# EasyEDA Pro project ESP32_wroom_A_V2.eprj, schematic main_esp32
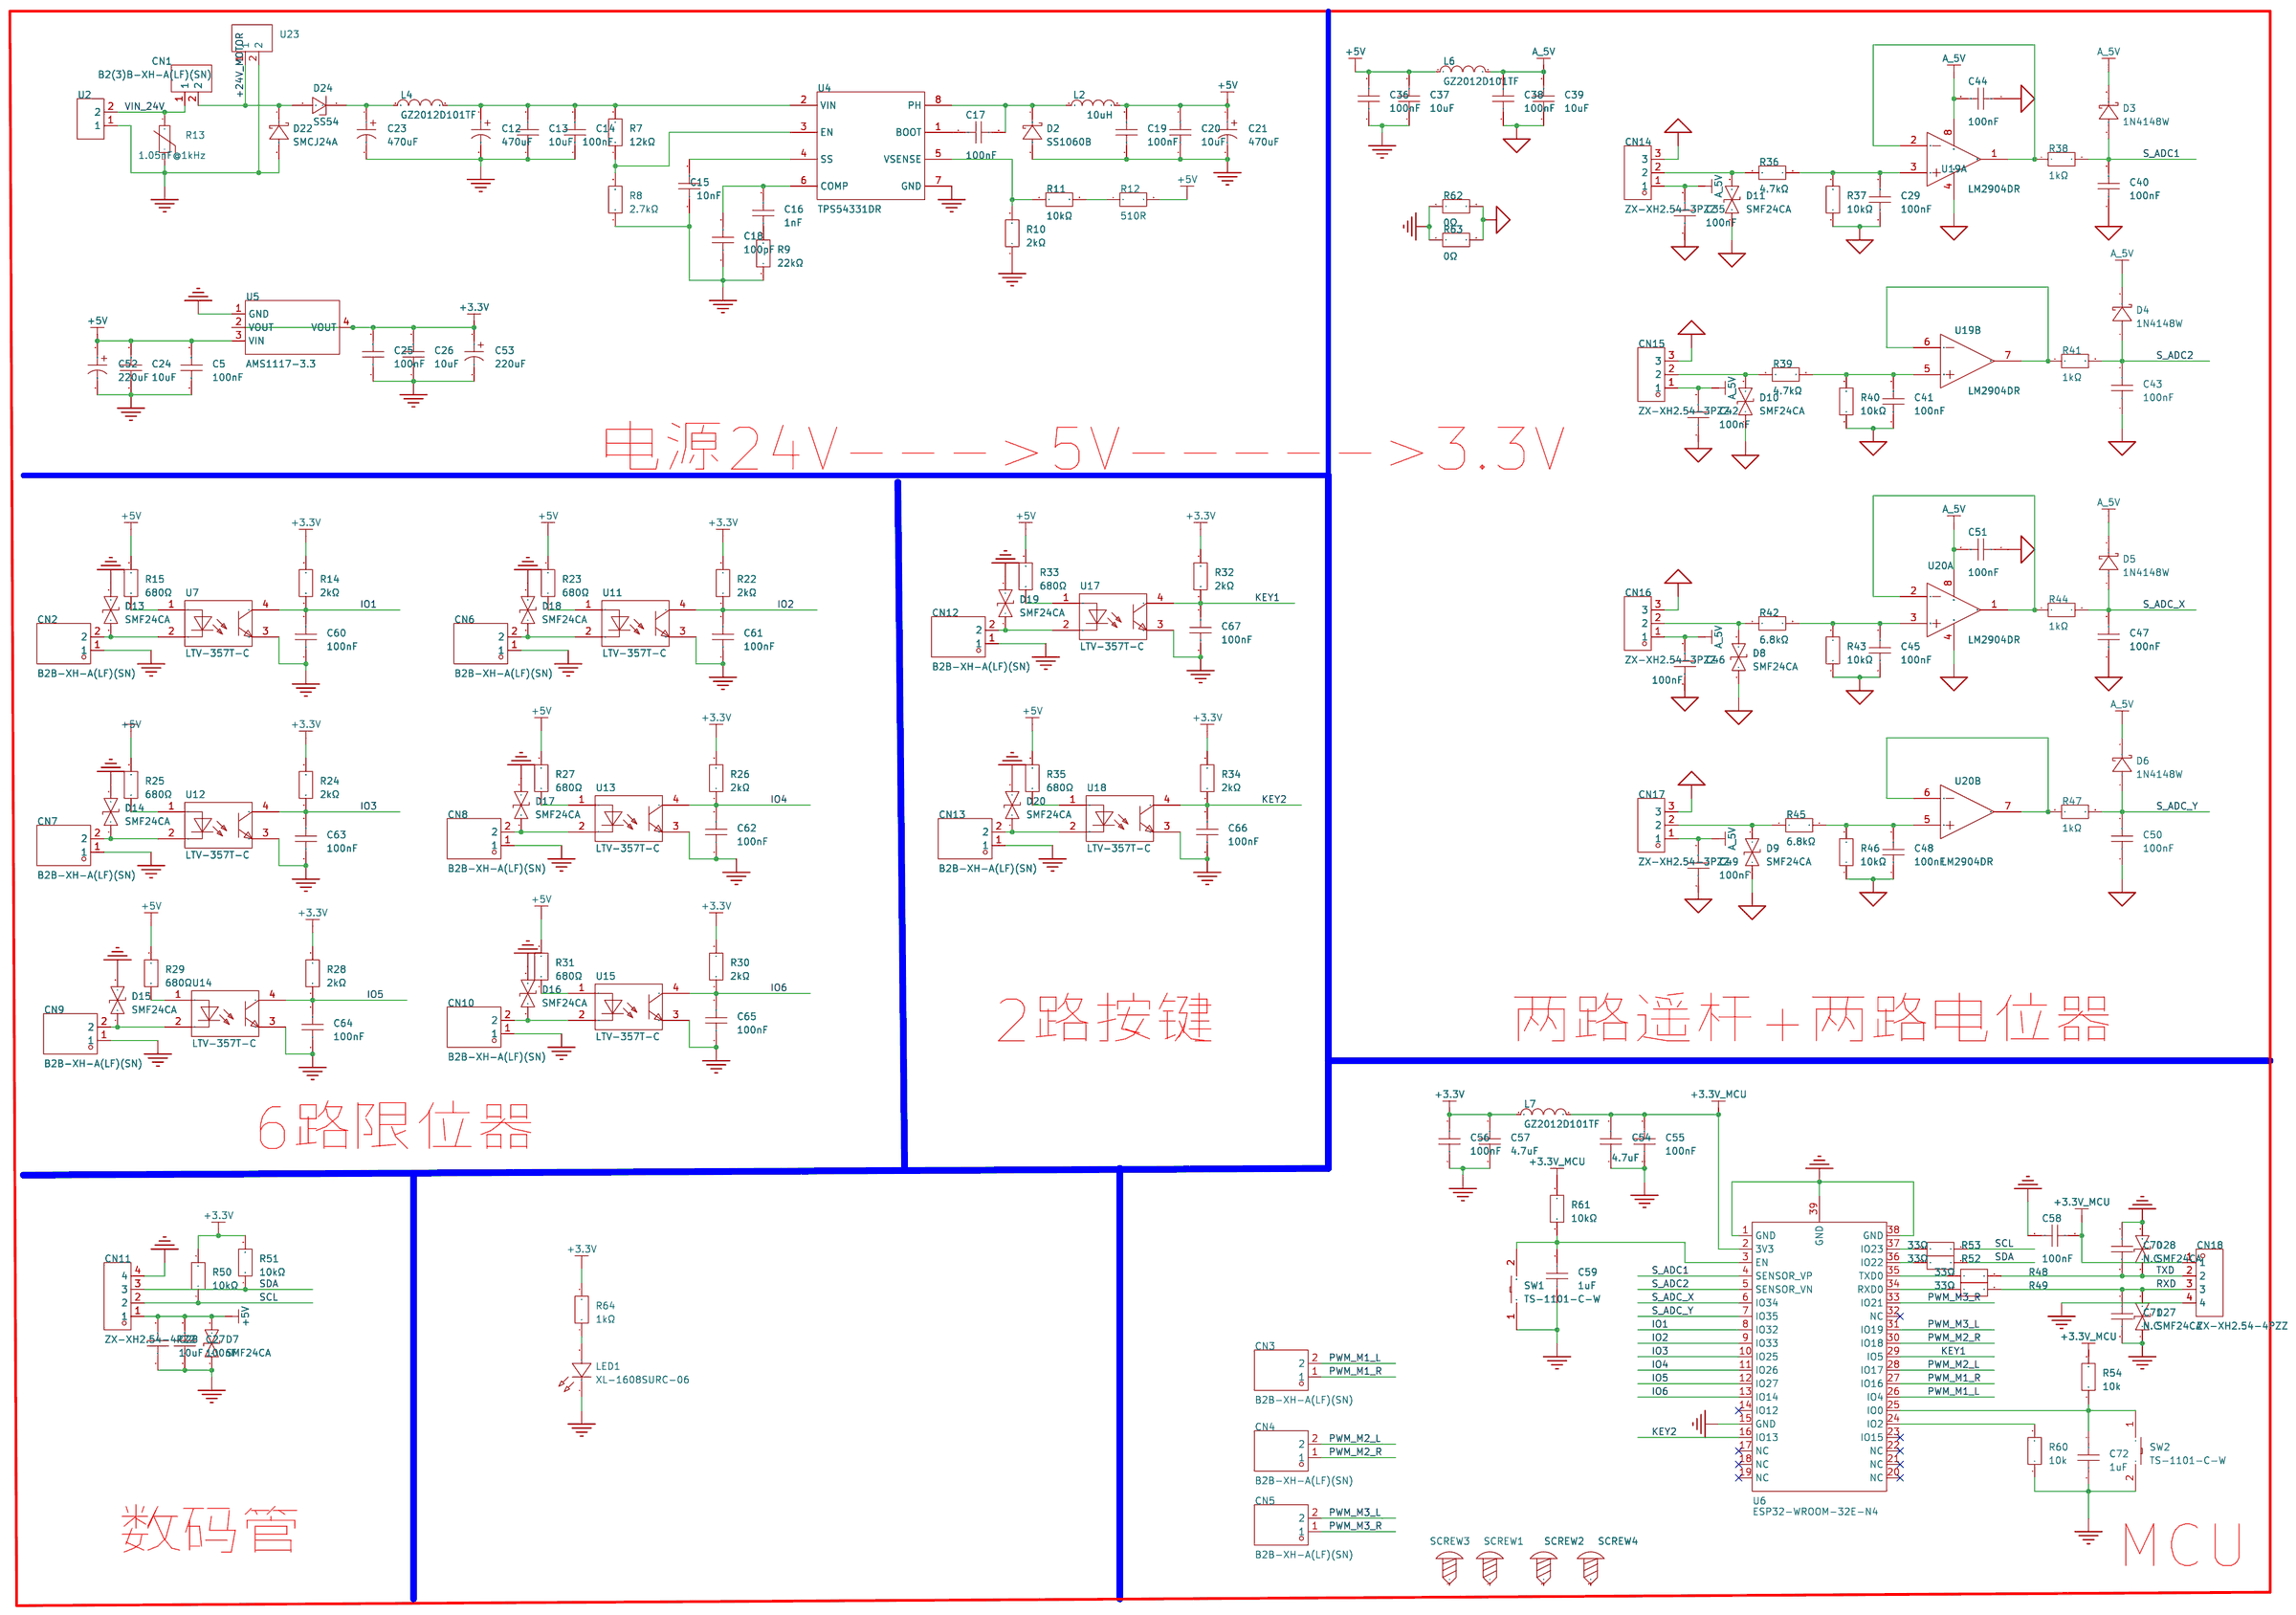
[diagram p0: schematic sheet]

## Parts
C5  100nF  [C0603]
C12  470uF  [CAP-TH_BD10.0-P5.00-D0.6-FD-A]
C13  10uF  [C0805]
C14  100nF  [C0603]
C15  10nF  [C0603]
C16  1nF  [C0603]
C17  100nF  [C0603]
C18  100pF  [C0603]
C19  100nF  [C0603]
C20  10uF  [C0805]
C21  470uF  [CAP-TH_BD10.0-P5.00-D0.6-FD-A]
C23  470uF  [CAP-TH_BD10.0-P5.00-D0.6-FD-A]
C24  10uF  [C0603]
C25  100nF  [C0603]
C26  10uF  [C0603]
C27  100nF  [C0603]
C28  10uF  [C0603]
C29  100nF  [C0603]
C35  100nF  [C0603]
C36  100nF  [C0603]
C37  10uF  [C0603]
C38  100nF  [C0603]
C39  10uF  [C0603]
C40  100nF  [C0603]
C41  100nF  [C0603]
C42  100nF  [C0603]
C43  100nF  [C0603]
C44  100nF  [C0603]
C45  100nF  [C0603]
C46  100nF  [C0603]
C47  100nF  [C0603]
C48  100nF  [C0603]
C49  100nF  [C0603]
C50  100nF  [C0603]
C51  100nF  [C0603]
C52  220uF  [CAP-TH_BD10.0-P5.00-D0.6-FD-A]
C53  220uF  [CAP-TH_BD10.0-P5.00-D0.6-FD-A]
C54  4.7uF  [C0603]
C55  100nF  [C0603]
C56  100nF  [C0603]
C57  4.7uF  [C0603]
C58  100nF  [C0603]
C59  1uF  [C0603]
C60  100nF  [C0603]
C61  100nF  [C0603]
C62  100nF  [C0603]
C63  100nF  [C0603]
C64  100nF  [C0603]
C65  100nF  [C0603]
C66  100nF  [C0603]
C67  100nF  [C0603]
C70  N.C  [C0603]
C71  N.C  [C0603]
C72  1uF  [C0603]
CN1  B2(3)B-XH-A(LF)(SN)  [CONN-TH_2P-V-P5.00-R_B2-3B-XH-A-LF-SN]
CN2  B2B-XH-A(LF)(SN)  [CONN-TH_B2B-XH-A-LF-SN]
CN3  B2B-XH-A(LF)(SN)  [CONN-TH_B2B-XH-A-LF-SN]
CN4  B2B-XH-A(LF)(SN)  [CONN-TH_B2B-XH-A-LF-SN]
CN5  B2B-XH-A(LF)(SN)  [CONN-TH_B2B-XH-A-LF-SN]
CN6  B2B-XH-A(LF)(SN)  [CONN-TH_B2B-XH-A-LF-SN]
CN7  B2B-XH-A(LF)(SN)  [CONN-TH_B2B-XH-A-LF-SN]
CN8  B2B-XH-A(LF)(SN)  [CONN-TH_B2B-XH-A-LF-SN]
CN9  B2B-XH-A(LF)(SN)  [CONN-TH_B2B-XH-A-LF-SN]
CN10  B2B-XH-A(LF)(SN)  [CONN-TH_B2B-XH-A-LF-SN]
CN11  ZX-XH2.54-4PZZ  [CONN-TH_4P-P2.50_4PIN]
CN12  B2B-XH-A(LF)(SN)  [CONN-TH_B2B-XH-A-LF-SN]
CN13  B2B-XH-A(LF)(SN)  [CONN-TH_B2B-XH-A-LF-SN]
CN14  ZX-XH2.54-3PZZ  [CONN-TH_3P-P2.54_2501S-3P]
CN15  ZX-XH2.54-3PZZ  [CONN-TH_3P-P2.54_2501S-3P]
CN16  ZX-XH2.54-3PZZ  [CONN-TH_3P-P2.54_2501S-3P]
CN17  ZX-XH2.54-3PZZ  [CONN-TH_3P-P2.54_2501S-3P]
CN18  ZX-XH2.54-4PZZ  [CONN-TH_4P-P2.50_4PIN]
D2  SS1060B  [SMB_L4.3-W3.6-LS5.3-RD]
D3  1N4148W  [SOD-123_L2.7-W1.6-LS3.7-FD]
D4  1N4148W  [SOD-123_L2.7-W1.6-LS3.7-FD]
D5  1N4148W  [SOD-123_L2.7-W1.6-LS3.7-FD]
D6  1N4148W  [SOD-123_L2.7-W1.6-LS3.7-FD]
D7  SMF24CA  [SOD-123FL_L2.7-W1.8-LS3.8-BI]
D8  SMF24CA  [SOD-123FL_L2.7-W1.8-LS3.8-BI]
D9  SMF24CA  [SOD-123FL_L2.7-W1.8-LS3.8-BI]
D10  SMF24CA  [SOD-123FL_L2.7-W1.8-LS3.8-BI]
D11  SMF24CA  [SOD-123FL_L2.7-W1.8-LS3.8-BI]
D13  SMF24CA  [SOD-123FL_L2.7-W1.8-LS3.8-BI]
D14  SMF24CA  [SOD-123FL_L2.7-W1.8-LS3.8-BI]
D15  SMF24CA  [SOD-123FL_L2.7-W1.8-LS3.8-BI]
D16  SMF24CA  [SOD-123FL_L2.7-W1.8-LS3.8-BI]
D17  SMF24CA  [SOD-123FL_L2.7-W1.8-LS3.8-BI]
D18  SMF24CA  [SOD-123FL_L2.7-W1.8-LS3.8-BI]
D19  SMF24CA  [SOD-123FL_L2.7-W1.8-LS3.8-BI]
D20  SMF24CA  [SOD-123FL_L2.7-W1.8-LS3.8-BI]
D22  SMCJ24A  [SMC_L6.9-W5.9-LS7.9-RD]
D24  SS54  [SMA_L4.3-W2.6-LS5.0-FD]
D27  SMF24CA  [SOD-123FL_L2.7-W1.8-LS3.8-BI]
D28  SMF24CA  [SOD-123FL_L2.7-W1.8-LS3.8-BI]
L2  10uH  [IND-SMD_L7.1-W6.6]
L4  GZ2012D101TF  [L0805]
L6  GZ2012D101TF  [L0805]
L7  GZ2012D101TF  [L0805]
LED1  XL-1608SURC-06  [LED0603-RD_RED]
R7  12kΩ  [R0603]
R8  2.7kΩ  [R0603]
R9  22kΩ  [R0603]
R10  2kΩ  [R0603]
R11  10kΩ  [R0603]
R12  510R  [R0603]
R13  1.05nF@1kHz  [RES-TH_L21.5-W6.8-P10.00-D1.0-S3.10]
R14  2kΩ  [R0603]
R15  680Ω  [R0603]
R22  2kΩ  [R0603]
R23  680Ω  [R0603]
R24  2kΩ  [R0603]
R25  680Ω  [R0603]
R26  2kΩ  [R0603]
R27  680Ω  [R0603]
R28  2kΩ  [R0603]
R29  680Ω  [R0603]
R30  2kΩ  [R0603]
R31  680Ω  [R0603]
R32  2kΩ  [R0603]
R33  680Ω  [R0603]
R34  2kΩ  [R0603]
R35  680Ω  [R0603]
R36  4.7kΩ  [R0603]
R37  10kΩ  [R0603]
R38  1kΩ  [R0603]
R39  4.7kΩ  [R0603]
R40  10kΩ  [R0603]
R41  1kΩ  [R0603]
R42  6.8kΩ  [R0603]
R43  10kΩ  [R0603]
R44  1kΩ  [R0603]
R45  6.8kΩ  [R0603]
R46  10kΩ  [R0603]
R47  1kΩ  [R0603]
R48  33Ω  [R0603]
R49  33Ω  [R0603]
R50  10kΩ  [R0603]
R51  10kΩ  [R0603]
R52  33Ω  [R0603]
R53  33Ω  [R0603]
R54  10k  [R0603]
R60  10k  [R0603]
R61  10kΩ  [R0603]
R62  0Ω  [R0603]
R63  0Ω  [R0603]
R64  1kΩ  [R0603]
SCREW1  -  [M3螺丝]
SCREW2  -  [M3螺丝]
SCREW3  -  [M3螺丝]
SCREW4  -  [M3螺丝]
SW1  TS-1101-C-W  [SW-SMD_L6.0-W3.3-LS8.0]
SW2  TS-1101-C-W  [SW-SMD_L6.0-W3.3-LS8.0]
U2  1935161  [CONN-TH_2P-P5.00_1935161]
U4  TPS54331DR  [SOIC-8_L5.0-W4.0-P1.27-LS6.0-BL]
U5  AMS1117-3.3  [SOT-223-3_L6.5-W3.4-P2.30-LS7.0-BR]
U6  ESP32-WROOM-32E-N4  [WIFI-SMD_ESP32-WROOM-32E]
U7  LTV-357T-C  [SOP-4_L4.4-W3.9-P2.54-LS7.0-TL]
U11  LTV-357T-C  [SOP-4_L4.4-W3.9-P2.54-LS7.0-TL]
U12  LTV-357T-C  [SOP-4_L4.4-W3.9-P2.54-LS7.0-TL]
U13  LTV-357T-C  [SOP-4_L4.4-W3.9-P2.54-LS7.0-TL]
U14  LTV-357T-C  [SOP-4_L4.4-W3.9-P2.54-LS7.0-TL]
U15  LTV-357T-C  [SOP-4_L4.4-W3.9-P2.54-LS7.0-TL]
U17  LTV-357T-C  [SOP-4_L4.4-W3.9-P2.54-LS7.0-TL]
U18  LTV-357T-C  [SOP-4_L4.4-W3.9-P2.54-LS7.0-TL]
U19  LM2904DR  [SOIC-8_L4.9-W3.9-P1.27-LS6.0-BL]  (sections 1,2)
U20  LM2904DR  [SOIC-8_L4.9-W3.9-P1.27-LS6.0-BL]  (sections 1,2)
U23  1935161  [CONN-TH_2P-P5.00_1935161]

## Library data of the parts
C5 C14-C19 C24-C29 C35-C51 C54-C67 C70-C72 = CGA0603X7R104K500JT: 容值:100nF;精度:±10%;额定电压:50V;温度系数:X7R;; LCSC Part Name: 100nF ±10% 50V; Supplier Part: C6119867; Manufacturer: HRE(芯声); Supplier Footprint: 0603; JLCPCB Part Class: 扩展库; Datasheet: https://atta.szlcsc.com/upload/public/pdf/source/20250103/C44077DA9E7B3EFAE02F22B6D3D1CBC9.pdf; Supplier: LCSC; Tolerance: ±10%; Voltage Rating: 50V; Temperature Coefficient: X7R
C12 C21 C23 C52 C53 = PA50V470M10x17: 容值:470uF;精度:±20%;额定电压:50V;纹波电流:4.1A@100kHz;等效串联电阻(ESR):18mΩ@100kHz;类型:聚合物;; LCSC Part Name: 470uF ±20% 50V; Supplier Part: C46550425; Manufacturer: 捷而瑞; Supplier Footprint: 插件,D10xL17mm; JLCPCB Part Class: 扩展库; Datasheet: https://atta.szlcsc.com/upload/public/pdf/source/20250307/831193F737CAF6D75AC25F14E955F0EC.pdf; Supplier: LCSC; Tolerance: ±20%; Voltage Rating: 50V; Ripple Current: 4.1A@100kHz; Equivalent Series Resistance(ESR): 18mΩ@100kHz; Type: 聚合物; Diameter: 10mm; Height - Seated (Max): 17mm; Lifetime: 2000hrs@105℃; Operating Temperature: -55℃~+105℃
C13 C20 = GRM21BR61H106KE43L: 容值:10uF;精度:±10%;额定电压:50V;材质(温度系数):X5R;; LCSC Part Name: 10uF ±10% 50V; Supplier Part: C440198; Manufacturer: muRata(村田); Supplier Footprint: 0805; JLCPCB Part Class: 基础库; Datasheet: https://atta.szlcsc.com/upload/public/pdf/source/20230811/95AAE0C9AF55EDC31B7A4D8B733F534E.pdf; Supplier: LCSC; Tolerance: ±10%; Voltage Rated: 50V; Temperature Coefficient: X5R
CN1 = B2(3)B-XH-A(LF)(SN): 插针结构:1x3P(缺1P);间距:5mm;安装方式:直插;参考系列:XH;总PIN数:2P(3P缺1P);排数:1;每排PIN数:3;行距:-;额定电流:3A;触头材质:黄铜;触头镀层:锡;工作温度:-25℃~+85℃;; LCSC Part Name: 1x3P(缺1P) 间距:5mm 直插 系列:XH; Supplier Part: C265001; Manufacturer: JST; Supplier Footprint: 插件,P=5mm; JLCPCB Part Class: Extended Part; Datasheet: https://atta.szlcsc.com/upload/public/pdf/source/20190614/C398493_2A26C609EB2B4F459A9F9915FD61E478.pdf; Supplier: LCSC; Pins Structure: 1x3P(缺1P); Pitch: 5mm; Mounting Type: 直插; Reference Series: XH; Number of Pins: 2P(3P缺1P); Number of Rows: 1; Number of PINs Per Row: 3; Current Rating: 3A; Contact Material: 黄铜; Contact Plating: 锡; Operating Temperature: -25℃~+85℃; Voltage Rating: 250V; Plastic Material: PA66; Flame Retardant Rating: UL94V-0; Supplementary Features: 打K脚；缺PIN; Color: 白色; Z-Height of the Board: 7mm; Y-Width of Bottom Edge on Board: 5.75mm
CN2-CN10 CN12 CN13 = B2B-XH-A(LF)(SN): 插针结构:1x2P;间距:2.5mm;安装方式:直插;参考系列:XH;总PIN数:2P;排数:1;每排PIN数:2;行距:-;额定电流:3A;触头材质:黄铜;触头镀层:锡;工作温度:-25℃~+85℃;; LCSC Part Name: 1x2P 间距:2.5mm 直插 系列:XH; Supplier Part: C158012; Manufacturer: JST; Supplier Footprint: 插件,P=2.5mm; JLCPCB Part Class: 扩展库; Datasheet: https://item.szlcsc.com/datasheet/B2B-XH-A(LF)(SN)/169360.html; Supplier: LCSC; Pins Structure: 1x2P; Pitch: 2.5mm; Mounting Type: 直插; Reference Series: XH; Number of Pins: 2P; Number of Rows: 1; Number of PINs Per Row: 2; Current Rating: 3A; Contact Material: 黄铜; Contact Plating: 锡; Operating Temperature: -25℃~+85℃; Voltage Rating: 250V; Plastic Material: PA66; Flame Retardant Rating: UL94V-0; Supplementary Features: 打K脚; Color: 白色; Z-Height of the Board: 7mm; X-Length of Bottom Edge on Board (Spacing Line): 7.4mm; Y-Width of Bottom Edge on Board: 5.75mm
CN11 CN18 = ZX-XH2.54-4PZZ: 插针结构:1x4P;间距:2.5mm;安装方式:直插;参考系列:XH;总PIN数:4P;排数:1;每排PIN数:4;行距:-;额定电流:3A;触头材质:黄铜;触头镀层:锡;工作温度:-25℃~+85℃;; LCSC Part Name: 1x4P 间距:2.5mm 直插 系列:XH; Supplier Part: C7429634; Manufacturer: Megastar(兆星); Supplier Footprint: 插件,P=2.5mm; JLCPCB Part Class: 扩展库; Datasheet: https://item.szlcsc.com/datasheet/ZX-XH2.54-4PZZ/8427551.html; Supplier: LCSC; Pins Structure: 1x4P; Pitch: 2.5mm; Mounting Type: 直插; Reference Series: XH; Number of Pins: 4P; Number of Rows: 1; Number of PINs Per Row: 4; Current Rating: 3A; Contact Material: 黄铜; Contact Plating: 锡; Operating Temperature: -25℃~+85℃; Voltage Rating: 250V; Plastic Material: PA66; Flame Retardant Rating: UL94V-0; Color: 白色; Z-Height of the Board: 7mm; X-Length of Bottom Edge on Board (Spacing Line): 12.5mm; Y-Width of Bottom Edge on Board: 5.9mm
CN14-CN17 = ZX-XH2.54-3PZZ: 插针结构:1x3P;间距:2.5mm;安装方式:直插;参考系列:XH;总PIN数:3P;排数:1;每排PIN数:3;行距:-;额定电流:3A;触头材质:黄铜;触头镀层:锡;工作温度:-25℃~+85℃;; LCSC Part Name: 1x3P 间距:2.5mm 直插 系列:XH; Supplier Part: C7429633; Manufacturer: Megastar(兆星); Supplier Footprint: 插件,P=2.5mm; JLCPCB Part Class: 扩展库; Datasheet: https://item.szlcsc.com/datasheet/ZX-XH2.54-3PZZ/8427550.html; Supplier: LCSC; Pins Structure: 1x3P; Pitch: 2.5mm; Mounting Type: 直插; Reference Series: XH; Number of Pins: 3P; Number of Rows: 1; Number of PINs Per Row: 3; Current Rating: 3A; Contact Material: 黄铜; Contact Plating: 锡; Operating Temperature: -25℃~+85℃; Voltage Rating: 250V; Plastic Material: PA66; Flame Retardant Rating: UL94V-0; Color: 白色; Z-Height of the Board: 7mm; X-Length of Bottom Edge on Board (Spacing Line): 10mm; Y-Width of Bottom Edge on Board: 5.9mm
D2 = SS1060B_C18208635: 正向压降(Vf):700mV@10A;直流反向耐压(Vr):60V;整流电流:10A;; LCSC Part Name: 电压:60V 电流:10A; Supplier Part: C18208635; Manufacturer: Slkor(萨科微); Supplier Footprint: SMB; JLCPCB Part Class: 扩展库; Datasheet: https://item.szlcsc.com/datasheet/SS1060B/19373155.html; Supplier: LCSC; Voltage - Forward(Vf@If): 700mV@10A; Voltage - DC Reverse(Vr): 60V; Current - Rectified: 10A; Reverse Leakage Current (Ir): 100nA@60V; Operating Junction Temperature Range: -55℃~+150℃
D3-D6 = 1N4148W_C7420318: 二极管配置:独立式;正向压降(Vf):1.25V@150mA;直流反向耐压(Vr):100V;整流电流:150mA;反向恢复时间(Trr):4ns;; Supplier Part: C7420318; Manufacturer: 宏嘉诚; Supplier Footprint: SOD-123; JLCPCB Part Class: 扩展库; Datasheet: https://item.szlcsc.com/datasheet/1N4148W/8397140.html; Supplier: LCSC; Diode Configuration: 独立式; Voltage - Forward(Vf@If): 1.25V@150mA; Voltage - DC Reverse(Vr): 100V; Current - Rectified: 150mA; Pd - Power Dissipation: 400mW; Reverse Leakage Current (Ir): 1uA@75V; Reverse Recovery Time (trr): 4ns; Operating Junction Temperature Range: -55℃~+150℃; Non-Repetitive Peak Forward Surge Current: 2A
D7-D11 D13-D20 D27 D28 = SMF24CA_C19077515: 极性:双向;反向截止电压(Vrwm):24V;最大钳位电压:38.9V;峰值脉冲电流(Ipp)@10/1000us:5.1A;峰值脉冲功率(Ppp)@10/1000us:200W;击穿电压:29.5V;; Supplier Part: C19077515; Manufacturer: 宏迦橙; Supplier Footprint: SOD-123FL; JLCPCB Part Class: 扩展库; Datasheet: https://atta.szlcsc.com/upload/public/pdf/source/20231129/4813F17DC56F8B344A8D004597B3633C.pdf; Supplier: LCSC; polarity: 双向; Reverse Stand-Off Voltage (Vrwm): 24V; Maximum Clamping Voltage: 38.9V; Peak Pulse Current (Ipp)@10/1000us: 5.1A; Peak Pulse Power Dissipation (Ppp)@10/1000us: 200W; Breakdown Voltage: 29.5V; Reverse Leakage Current (Ir): 1uA; Operating Temperature: -55℃~+155℃; Type: TVS
D22 = SMCJ24A_C19077604: 极性:单向;反向截止电压(Vrwm):24V;钳位电压:38.9V;峰值脉冲电流(Ipp):38.6A@10/1000us;峰值脉冲功率(Ppp):1.5kW@10/1000us;击穿电压:29.5V;; Supplier Part: C19077604; Manufacturer: 宏嘉诚; Supplier Footprint: SMC; JLCPCB Part Class: 扩展库; Datasheet: https://item.szlcsc.com/datasheet/SMCJ24A/20275689.html; Supplier: LCSC; Polarity: 单向; Reverse Stand-Off Voltage (Vrwm): 24V; Clamping Voltage: 38.9V; Peak Pulse Current (Ipp): 38.6A@10/1000us; Peak Pulse Power Dissipation (Ppp): 1.5kW@10/1000us; Voltage - Breakdown: 29.5V; Reverse Leakage Current (Ir): 1uA; Operating Temperature: -55℃~+150℃; level of protection: IEC 61000-4-2; Type: TVS
D24 = SS54_C7420369: 二极管配置:独立式;正向压降(Vf):550mV@5.0A;直流反向耐压(Vr):40V;整流电流:5A;; LCSC Part Name: 电压:40V 电流:5A; Supplier Part: C7420369; Manufacturer: 宏嘉诚; Supplier Footprint: SMA(DO-214AC); JLCPCB Part Class: 扩展库; Datasheet: https://item.szlcsc.com/datasheet/SS54/8397191.html; Supplier: LCSC; Diode Configuration: 独立式; Voltage - Forward(Vf@If): 550mV@5.0A; Voltage - DC Reverse(Vr): 40V; Current - Rectified: 5A; Reverse Leakage Current (Ir): 50uA@40V; Operating Junction Temperature Range: -55℃~+125℃; Non-Repetitive Peak Forward Surge Current: 120A
L2 = D0630HP-100MT: 电感值:10uH;精度:±20%;饱和电流(Isat):4.5A;类型:一体成型电感;; LCSC Part Name: 一体成型电感 0630-10UH 10uH ±20%; Supplier Part: C41410464; Manufacturer: DEYAN(德砚电子); Supplier Footprint: SMD,7.1x6.6mm; JLCPCB Part Class: 扩展库; Datasheet: https://item.szlcsc.com/datasheet/D0630HP-100MT/43219172.html; Supplier: LCSC; Tolerance: ±20%; Current - Saturation(Isat): 4.5A; DC Resistance(DCR): 68mΩ; Type: 一体成型电感
L4 L6 L7 = GZ2012D101TF: 阻抗@频率:100Ω@100MHz;误差:±25%;直流电阻(DCR):150mΩ;; LCSC Part Name: 单路 0805磁珠 阻抗100Ω@100MHz; Supplier Part: C1015; Manufacturer: Sunlord(顺络); Supplier Footprint: 0805; JLCPCB Part Class: 基础库; Datasheet: https://atta.szlcsc.com/upload/public/pdf/source/20241120/893429B990C3BA07384E734821D2F218.pdf; Supplier: LCSC; Impedance @ Frequency: 100Ω@100MHz; Tolerance: ±25%; DC Resistance(DCR): 150mΩ; Current Rating: 800mA; Number of Circuits: 1
LED1 = XL-1608SURC-06: 灯头类型:-;发光颜色:红色;正向压降(Vf):2.3V;功率:50mW;正向电流:20mA;波长:620nm~630nm;二极管配置:-;透镜颜色:无色透明透镜;色温:-;发光强度:225mcd;发光角度:120°;载带方式:正贴;工作温度:-40℃~+85℃;; LCSC Part Name: 0603红色贴片式发光二极管; Supplier Part: C965799; Manufacturer: XINGLIGHT(成兴光); Supplier Footprint: 0603; JLCPCB Part Class: 扩展库; Datasheet: https://item.szlcsc.com/datasheet/XL-1608SURC-06/1051408.html; Supplier: LCSC; Illumination Color: 红色; Voltage - Forward(Vf): 2.3V; Power(Watts): 50mW; Forward Current: 20mA; Wavelength - Dominant: 620nm~630nm; Peak Wavelength: 625nm; Lens Color: 无色透明透镜; Luminous Intensity: 225mcd; Viewing Angle: 120°; Mounting Style: 正贴; Operating Temperature: -40℃~+85℃
R7-R12 R14 R15 R22-R54 R60-R64 = FRC0603J123 TS: 电阻类型:厚膜电阻;阻值:12kΩ;精度:±5%;功率:100mW;工作电压:75V;温度系数:±100ppm/℃;; LCSC Part Name: 12kΩ ±5% 100mW 厚膜电阻; Supplier Part: C2907097; Manufacturer: FOJAN(富捷); Supplier Footprint: 0603; JLCPCB Part Class: 扩展库; Datasheet: https://item.szlcsc.com/datasheet/FRC0603J123%2520TS/3180610.html; Supplier: LCSC; Type: 厚膜电阻; Tolerance: ±5%; Power(Watts): 100mW; Voltage-Supply(Max): 75V; Temperature Coefficient: ±100ppm/℃; Operating Temperature: -55℃~+155℃
R13 = 20D471K_C49069720: 压敏电压:470V;钳位电压:775V;工作电压(DC):385V;工作电压(AC):300V;; LCSC Part Name: 20D471K; Supplier Part: C49069720; Manufacturer: 宏嘉诚; Manufacturer Part: 20D471K; Supplier Footprint: 插件,P=10mm; JLCPCB Part Class: 扩展库; Datasheet: https://item.szlcsc.com/datasheet/20D471K/51445286.html; Supplier: LCSC; Varistor Voltage: 470V; Clamping Voltage: 775V; Maximum DC Volts: 385V; Maximum AC Volts: 300V; Peak Current: 6.5kA; Energy: 224J; Rated Wattage: 1W
SCREW1-SCREW4 = M3螺丝: Supplier Footprint: 插件
SW1 SW2 = TS-1101-C-W: 电路结构:单刀单掷;按钮形状:矩形按钮;作用力:260gf;安装方式:立贴;开关长度:6mm;开关宽度:3.6mm;开关高度:2.5mm;带支架:不带;触点电流:50mA;额定电压(AC):-;额定电压(DC):12V;额定功率:-;绝缘电阻:-;带灯:无;机械寿命:5万次;; LCSC Part Name: 6*3.6*2.5mm 立贴 轻触开关; Supplier Part: C318938; Manufacturer: XKB Connectivity(中国星坤); Supplier Footprint: SMD; JLCPCB Part Class: 扩展库; Datasheet: https://atta.szlcsc.com/upload/public/pdf/source/20200227/C318938_C2E53B1EEDE37D980A33616AC086DE53.pdf; Supplier: LCSC; Circuit: 单刀单掷; Actuator Style: 矩形按钮; Operating Force: 260gf; Mounting Style: 立贴; Switch Length: 6mm; Switch Width: 3.6mm; Switch Height: 2.5mm; Strike Gundam: 不带; Contact Current: 50mA; Voltage Rating (DC): 12V; Actuator/Cap Color: 白色带淡绿; With Lamp: 无; Mechanical Life: 5万次; Operating Temperature: -30℃~+85℃
U2 U23 = 1935161: 结构:1x2P;间距:5mm;颜色:绿色;安装方式:直插;排数:1;每排PIN数:2;额定电流:18A;额定电压:300V;线规 - AWG:12~26;工作温度:-;; LCSC Part Name: 5mm 1x2P 排数:1 每排P数:2 直插; Supplier Part: C3819953; Manufacturer: Phoenix Contact(菲尼克斯); Supplier Footprint: 插件,P=5mm; JLCPCB Part Class: 扩展库; Datasheet: https://item.szlcsc.com/datasheet/1935161/4387627.html; Supplier: LCSC; Number of Positions or Pins: 1x2P; Pitch: 5mm; Color: 绿色; Mounting Type: 直插; Number of Pins: 2P; Number of Rows: 1; Number of PINs Per Row: 2; Current Rating: 18A; Voltage Rating (Max): 300V; Wire Gauge - AWG: 12~26
U4 = TPS54331DR: 功能类型:降压型;输出类型:可调;工作电压:3.5V~28V;输出电压:-;输出电流:3A;; LCSC Part Name: 3A, 28V 输入非同步降压转换器; Supplier Part: C9865; Manufacturer: TI(德州仪器); Supplier Footprint: SOIC-8; JLCPCB Part Class: 扩展库; Datasheet: https://www.ti.com/cn/lit/gpn/tps54331; Supplier: LCSC; Function: 降压型; Output Type: 可调; Input Voltage: 3.5V~28V; Output Current: 3A; Switching Frequency: 570kHz; Operating Temperature: -40℃~+150℃@(TJ); Synchronous Rectification: 否; Number of Outputs: 1; Topology: 降压式; Quiescent Current (Iq): 1mA; Switch tube (built-in/external): 内置
U5 = AMS1117-3.3_C6186: 输出类型:固定;工作电压:16V;输出电压:3.3V;输出电流:1A;电源纹波抑制比(PSRR):72dB@(120Hz);输出极性:正极;; LCSC Part Name: 输出3.3V 1A; Supplier Part: C6186; Manufacturer: AMS; Supplier Footprint: SOT-223; JLCPCB Part Class: 基础库; Datasheet: https://item.szlcsc.com/datasheet/AMS1117-3.3/6652.html; Supplier: LCSC; Output Type: 固定; Voltage - Supply: 16V; Output Voltage: 3.3V; Output Current: 1A; Power Supply Rejection Ratio (PSRR): 72dB@(120Hz); Voltage Dropout: 1.1V@(800mA); standby current: 5mA; Features: 过流保护；过热保护; Operating Temperature: -40℃~+125℃; Output Configuration: 正极; Number of Outputs: 1
U6 = ESP32-WROOM-32E-N4: ESP32-WROOM-32E 集成 ESP32-D0WD-V3 芯片，具有高的稳定性和安全性能。; LCSC Part Name: 通用型Wi-Fi+BT+BLE MCU模组; Supplier Part: C701341; Manufacturer: ESPRESSIF(乐鑫); Supplier Footprint: SMD,18x25.5mm; JLCPCB Part Class: 扩展库; Datasheet: https://item.szlcsc.com/datasheet/ESP32-WROOM-32E-N4/736349.html; Supplier: LCSC
U7 U11-U15 U17 U18 = LTV-357T-C: 输入电压类型:DC;正向电压:1.2V;输出电流:50mA;隔离电压(rms):3.75kV;反向电压:6V;负载电压:35V;输出通道数:1;集射极饱和电压(Vce(sat)@Ic,IF):200mV@1mA,20mA;; LCSC Part Name: DC输入 隔离电压(rms):3750V; Supplier Part: C119091; Manufacturer: LITEON(光宝); Supplier Footprint: SOP-4-2.54mm; JLCPCB Part Class: 扩展库; Datasheet: https://atta.szlcsc.com/upload/public/pdf/source/20170930/C133128_1506736380934997376.pdf; Supplier: LCSC; Input voltage type: DC; Output Type: 光电三极管; Forward Voltage: 1.2V; Output Current: 50mA; Isolation Voltage(rms): 3.75kV; Reverse Voltage: 6V; Load Voltage: 35V; Number of Outputs: 1; Collector-Emitter Saturation Voltage (Vce(sat)@Ic,IF): 200mV@1mA,20mA; Rise time: 4us@2mA,100Ω; Fall time: 3us@2mA,100Ω; Operating Temperature: -55℃~+110℃
U19 U20 = LM2904DR_C7934: 放大器数:双路;轨到轨:-;增益带宽积(GBP):-;输入失调电压(Vos):3mV;压摆率(SR):300V/ms;输入偏置电流(Ib):20nA;; LCSC Part Name: 双通道运算放大器; Supplier Part: C7934; Manufacturer: TI(德州仪器); Supplier Footprint: SOIC-8; JLCPCB Part Class: 扩展库; Datasheet: http://www.ti.com/cn/lit/gpn/lm358; Supplier: LCSC; Number of Channels: 双路; Maximum Power Supply Range (Vdd-Vss): 32V; Vos - Input Offset Voltage: 3mV; Input Offset Voltage Drift(Vos TC): 7uV/℃; Slew Rate: 300V/ms; Ib - Input Bias Current: 20nA; Noise density(eN): 40nV/√Hz@1kHz; Common Mode Rejection Ratio(CMRR): 80dB; Operating Temperature: -40℃~+125℃; Single supply: 3V~32V; Dual Supply: 1.5V~16V；-16V~-1.5V

## Nets
+3.3V: C25.2 C26.2 C53.1 C56.2 C57.2 L7.1 R14.2 R22.2 R24.2 R26.2 R28.2 R30.2 R32.2 R34.2 R50.2 R51.2 R64.2 U5.2(VOUT) U5.4(VOUT)
+3.3V_MCU: C54.2 C55.2 C58.1 CN18.1 L7.2 R54.2 R61.2 U6.2(3V3)
+5V: C5.2 C19.2 C20.2 C21.1 C24.2 C27.2 C28.2 C36.2 C37.2 C52.1 CN11.1 D7.2(A) L2.2 L6.1 R12.2 R15.2 R23.2 R25.2 R27.2 R29.2 R31.2 R33.2 R35.2 U5.3(VIN)
+24V_MOTOR: CN1.2 D22.1(-) D24.1(A) U23.1
AGND: C29.1 C35.1 C38.1 C39.1 C40.1 C41.1 C42.1 C43.1 C44.1 C45.1 C46.1 C47.1 C48.1 C49.1 C50.1 C51.1 CN14.3 CN15.3 CN16.3 CN17.3 D8.1(K) D9.1(K) D10.1(K) D11.1(K) R37.1 R40.1 R43.1 R46.1 R62.2 R63.2 U19.4(GND) U20.4(GND)
GND: C5.1 C12.2 C13.1 C14.1 C15.1 C18.1 C19.1 C20.1 C21.2 C23.2 C24.1 C25.1 C26.1 C27.1 C28.1 C36.1 C37.1 C52.2 C53.2 C54.1 C55.1 C56.1 C57.1 C58.2 C59.1 C60.1 C61.1 C62.1 C63.1 C64.1 C65.1 C66.1 C67.1 C70.1 C71.2 C72.2 CN2.1 CN6.1 CN7.1 CN8.1 CN9.1 CN10.1 CN11.4 CN12.1 CN13.1 CN18.4 D2.2(A) D7.1(K) D13.2(A) D14.2(A) D15.2(A) D16.2(A) D17.2(A) D18.2(A) D19.2(A) D20.2(A) D22.2(+) D27.1(K) D28.2(A) LED1.1(K) R8.1 R9.1 R10.1 R13.1 R60.1 R62.1 R63.1 SW1.1 SW2.2 U2.1 U4.7(GND) U5.1(GND) U6.1(GND) U6.15(GND) U6.38(GND) U6.39(GND) U7.3 U11.3 U12.3 U13.3 U14.3 U15.3 U17.3 U18.3 U23.2
VIN_24V: CN1.1 R13.2 U2.2
A_5V: C35.2 C38.2 C39.2 C42.2 C44.2 C46.2 C49.2 C51.2 CN14.1 CN15.1 CN16.1 CN17.1 D3.2(K) D4.2(K) D5.2(K) D6.2(K) L6.2 U19.8(VCC) U20.8(VCC)
IO1: C60.2 R14.1 U6.8(IO32) U7.4
IO2: C61.2 R22.1 U6.9(IO33) U11.4
IO3: C63.2 R24.1 U6.10(IO25) U12.4
IO4: C62.2 R26.1 U6.11(IO26) U13.4
IO5: C64.2 R28.1 U6.12(IO27) U14.4
IO6: C65.2 R30.1 U6.13(IO14) U15.4
KEY1: C67.2 R32.1 U6.29(IO5) U17.4
KEY2: C66.2 R34.1 U6.16(IO13) U18.4
PWM_M1_L: CN3.2 U6.26(IO4)
PWM_M1_R: CN3.1 U6.27(IO16)
PWM_M2_L: CN4.2 U6.28(IO17)
PWM_M2_R: CN4.1 U6.30(IO18)
PWM_M3_L: CN5.2 U6.31(IO19)
PWM_M3_R: CN5.1 U6.33(IO21)
RXD: C71.1 CN18.3 D27.2(A) R49.2
S_ADC1: C40.2 D3.1(A) R38.2 U6.4(SENSOR_VP)
S_ADC2: C43.2 D4.1(A) R41.2 U6.5(SENSOR_VN)
S_ADC_X: C47.2 D5.1(A) R44.2 U6.6(IO34)
S_ADC_Y: C50.2 D6.1(A) R47.2 U6.7(IO35)
SCL: CN11.2 R50.1 R53.2
SDA: CN11.3 R51.1 R52.2
TXD: C70.2 CN18.2 D28.1(K) R48.2
$1N2189: R7.1 R8.2 U4.3(EN)
$1N2195: C15.2 U4.4(SS)
$1N2200: C17.1 U4.1(BOOT)
$1N2202: C17.2 D2.1(C) L2.1 U4.8(PH)
$1N2211: C16.1 R9.2
$1N2213: C16.2 C18.2 U4.6(COMP)
$1N2217: R10.2 R11.1 U4.5(VSENSE)
$1N2224: R11.2 R12.1
$1N6170: C12.1 C13.2 C14.2 L4.2 R7.2 U4.2(VIN)
$1N6171: C23.1 D24.2(K) L4.1
$1N8286: R15.1 U7.1
$1N9712: R23.1 U11.1
$1N9946: R25.1 U12.1
$1N10180: R27.1 U13.1
$1N10414: R29.1 U14.1
$1N10648: R31.1 U15.1
$1N11847: R33.1 U17.1
$1N12081: R35.1 U18.1
$1N12085: CN13.2 D20.1(K) U18.2
$1N12741: C29.2 R36.2 R37.2 U19.3(1IN+)
$1N13662: R38.1 U19.1(1OUT) U19.2(1IN-)
$1N14073: C41.2 R39.2 R40.2 U19.5(2IN+)
$1N14257: R41.1 U19.6(2IN-) U19.7(2OUT)
$1N15266: C45.2 R42.2 R43.2 U20.3(1IN+)
$1N15283: R44.1 U20.1(1OUT) U20.2(1IN-)
$1N15298: C48.2 R45.2 R46.2 U20.5(2IN+)
$1N15324: R47.1 U20.6(2IN-) U20.7(2OUT)
$1N39408: R48.1 U6.35(TXD0)
$1N39500: R49.1 U6.34(RXD0)
$1N39750: R52.1 U6.36(IO22)
$1N39795: R53.1 U6.37(IO23)
$1N40526: R60.2 U6.24(IO2)
$1N99494: LED1.2(A) R64.1
Net-(C59-2): C59.2 R61.1 SW1.2 U6.3(EN)
Net-(C72-1): C72.1 R54.1 SW2.1 U6.25(IO0)
Net-(CN2-2): CN2.2 D13.1(K) U7.2
Net-(CN6-2): CN6.2 D18.1(K) U11.2
Net-(CN7-2): CN7.2 D14.1(K) U12.2
Net-(CN8-2): CN8.2 D17.1(K) U13.2
Net-(CN9-2): CN9.2 D15.1(K) U14.2
Net-(CN10-2): CN10.2 D16.1(K) U15.2
Net-(CN12-2): CN12.2 D19.1(K) U17.2
Net-(CN14-2): CN14.2 D11.2(A) R36.1
Net-(CN15-2): CN15.2 D10.2(A) R39.1
Net-(CN16-2): CN16.2 D8.2(A) R42.1
Net-(CN17-2): CN17.2 D9.2(A) R45.1

Not connected (* = marked no-connect by the designer): SCREW1 1; SCREW2 1; SCREW3 1; SCREW4 1; U6 14(IO12)* 17(NC)* 18(NC)* 19(NC)* 20(NC)* 21(NC)* 22(NC)* 23(IO15)* 32(NC)*

## Notes on the sheet
- 电源24V--->5V----->3.3V
- 2路按键
- 两路遥杆+两路电位器
- 6路限位器
- 数码管
- MCU
